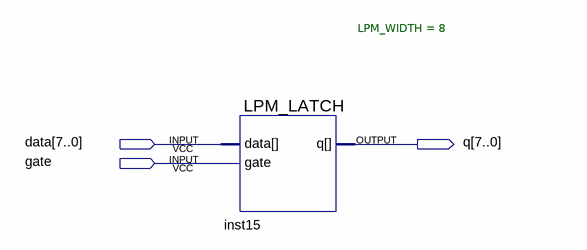
[diagram p0: schematic sheet]
// Quartus schematic latch.bdf as structural Verilog: 1 symbols, 3 pins
module latch (
  input  [7:0] data,
  input  gate,
  output [7:0] q
);

  LPM_LATCH #(.LPM_WIDTH(8)) inst15 (.data(data), .gate(gate), .q(q));
endmodule
